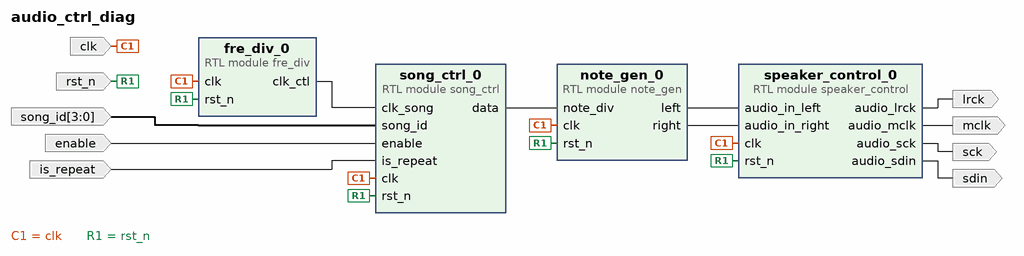
[diagram p0: block diagram of the top level]
# Vivado block design audio_ctrl_diag, xc7a35tcpg236-1, Vivado 2019.2
create_bd_design audio_ctrl_diag

create_bd_port -dir I clk
create_bd_port -dir I rst_n
create_bd_port -dir I -from 3 -to 0 song_id
create_bd_port -dir I enable
create_bd_port -dir I is_repeat
create_bd_port -dir O mclk
create_bd_port -dir O lrck
create_bd_port -dir O sck
create_bd_port -dir O sdin

create_bd_cell -type module -reference fre_div fre_div_0
create_bd_cell -type module -reference song_ctrl song_ctrl_0
set_property -dict {CONFIG.MUSIC_ADDR_BITS_N 10 CONFIG.MUSIC_DATA_BITS_N 22 CONFIG.SONG_ID_BITS_N 4} [get_bd_cells song_ctrl_0]
create_bd_cell -type module -reference note_gen note_gen_0
create_bd_cell -type module -reference speaker_control speaker_control_0

# ---- connections ----

connect_bd_net [get_bd_pins fre_div_0/clk_ctl] [get_bd_pins song_ctrl_0/clk_song]
connect_bd_net [get_bd_ports clk] \
  [get_bd_pins fre_div_0/clk] [get_bd_pins note_gen_0/clk] [get_bd_pins song_ctrl_0/clk] [get_bd_pins speaker_control_0/clk]
connect_bd_net [get_bd_ports rst_n] \
  [get_bd_pins fre_div_0/rst_n] [get_bd_pins song_ctrl_0/rst_n] [get_bd_pins note_gen_0/rst_n] \
  [get_bd_pins speaker_control_0/rst_n]
connect_bd_net [get_bd_pins song_ctrl_0/data] [get_bd_pins note_gen_0/note_div]
connect_bd_net [get_bd_pins note_gen_0/left] [get_bd_pins speaker_control_0/audio_in_left]
connect_bd_net [get_bd_pins note_gen_0/right] [get_bd_pins speaker_control_0/audio_in_right]
connect_bd_net [get_bd_ports song_id] [get_bd_pins song_ctrl_0/song_id]
connect_bd_net [get_bd_ports enable] [get_bd_pins song_ctrl_0/enable]
connect_bd_net [get_bd_ports is_repeat] [get_bd_pins song_ctrl_0/is_repeat]
connect_bd_net [get_bd_pins speaker_control_0/audio_mclk] [get_bd_ports mclk]
connect_bd_net [get_bd_pins speaker_control_0/audio_sck] [get_bd_ports sck]
connect_bd_net [get_bd_pins speaker_control_0/audio_lrck] [get_bd_ports lrck]
connect_bd_net [get_bd_pins speaker_control_0/audio_sdin] [get_bd_ports sdin]

validate_bd_design
save_bd_design
